# Altium schematic sheet Transmitter.SchDoc
size A4
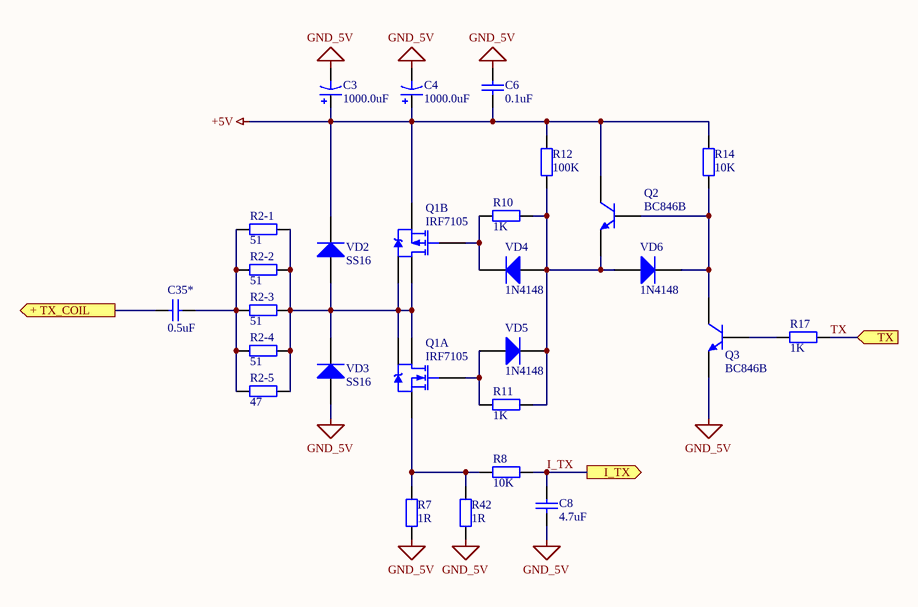
[diagram p0: Transmitter.SchDoc]

## Parts
C3  1000.0uF  [Capacitor-10X20-LYINGR]
C4  1000.0uF  [Capacitor-10X20-LYINGR]
C6  0.1uF  [1206_SMD_Capacitor]
C8  4.7uF  [1206_SMD_Capacitor]
C35*  0.5uF  [K71-7-LYING]
Q1  IRF7105  [SO-2]  (parts A,B of 2)
Q2  BC846B  [SOT23_N]
Q3  BC846B  [SOT23_N]
R2-1  51  [1206_SMD_Resistor]
R2-2  51  [1206_SMD_Resistor]
R2-3  51  [1206_SMD_Resistor]
R2-4  51  [1206_SMD_Resistor]
R2-5  47  [1206_SMD_Resistor]
R7  1R  [1206_SMD_Resistor]
R8  10K  [1206_SMD_Resistor]
R10  1K  [1206_SMD_Resistor]
R11  1K  [1206_SMD_Resistor]
R12  100K  [1206_SMD_Resistor]
R14  10K  [1206_SMD_Resistor]
R17  1K  [1206_SMD_Resistor]
R42  1R  [1206_SMD_Resistor]
VD2  SS16  [SMA]
VD3  SS16  [SMA]
VD4  1N4148  [SOD-323]
VD5  1N4148  [SOD-323]
VD6  1N4148  [SOD-323]

## Ports
+ TX_COIL (out), I_TX (out), TX (in)

## Nets
+5V: C3.1 C4.1 C6.1 Q1.3(S) Q2.3(C) R12.2 R14.2 VD2.2(K)
GND_5V: C3.2 C4.2 C6.2 C8.1 Q3.2(E) R7.2 R42.2 VD3.1(A)
+ TX_COIL: C35*.1 ; port + TX_COIL
I_TX: C8.2 R8.1 ; port I_TX
TX: R17.2 ; port TX
NetC35*_2: C35*.2 R2-1.1 R2-2.1 R2-3.1 R2-4.1 R2-5.1
NetQ1_1: Q1.1(S) R7.1 R8.2 R42.1
NetQ1_2: Q1.2(G) R11.2 VD5.1(A)
NetQ1_4: Q1.4(G) R10.2 VD4.2(K)
NetQ1_5: Q1.5(D) Q1.6 Q1.7(D) Q1.8 R2-1.2 R2-2.2 R2-3.2 R2-4.2 R2-5.2 VD2.1(A) VD3.2(K)
NetQ2_1: Q2.1(B) Q3.3(C) R14.1 VD6.2(K)
NetQ2_2: Q2.2(E) R10.1 R11.1 R12.1 VD4.1(A) VD5.2(K) VD6.1(A)
NetQ3_1: Q3.1(B) R17.1

## Library data of the parts
C3 C4 = Cap Pol1: Polarized Capacitor (Radial); Published: 8-Jun-2000; LatestRevisionDate: 17-Jul-2002; LatestRevisionNote: Re-released for DXP Platform.; PackageReference: RB7.6-15; Publisher: Altium Limited; PackageDescription: Polarized Capacitor (Radial); 2 Leads; Value: 1000.0uF
C6 C8 = Capacitor SMD: Capacitor; Published: 8-Jun-2000; LatestRevisionDate: 17-Jul-2002; LatestRevisionNote: Re-released for DXP Platform.; PackageReference: RAD-0.3; Publisher: Altium Limited
  C6: Value: 0.1uF
  C8: Value: 4.7uF
C35* = Capacitor K71-7: Capacitor; Published: 8-Jun-2000; LatestRevisionDate: 17-Jul-2002; LatestRevisionNote: Re-released for DXP Platform.; PackageReference: RAD-0.3; Publisher: Altium Limited; Value: 0.5uF
Q2 Q3 = BC846B: NPN General-purpose Transistor; Published: 17-Sep-2003; LatestRevisionDate: 12-Dec-2006; LatestRevisionNote: IPC-7351 Footprint Added.; DatasheetVersion: 4-Feb-2002; PackageVersion: May-1999; PackageReference: SOT23; Publisher: Altium Limited; PackageDescription: 3-Pin SOT-23 Package 0.95 mm Pitch, 2.3 mm Lead Span; ComponentLink1Description: Manufacturer Link; ComponentLink1URL: http://www.semiconductors.philips.com/; ComponentLink2Description: Datasheet; ComponentLink2URL: http://www.semiconductors.philips.com/acrobat/datasheets/BC846_BC847_BC848_5.pdf
R2-1-R2-5 R7 R8 R10-R12 R14 R17 R42 = Resistor: Published: 8-Jun-2000; LatestRevisionDate: 17-Jul-2002; LatestRevisionNote: Re-released for DXP Platform.; PackageReference: AXIAL-0.4; Publisher: Altium Limited; PackageDescription: Axial Device, Thru-Hole; 2 Leads; 0.4 in Pin Spacing
  R2-1-R2-4: Value: 51
  R2-5: Value: 47
  R7 R42: Value: 1R
  R8 R14: Value: 10K
  R10 R11 R17: Value: 1K
  R12: Value: 100K
VD2 VD3 = Diode: Default Diode; Published: 8-Jun-2000; LatestRevisionDate: 17-Jul-2002; LatestRevisionNote: Re-released for DXP Platform.; PackageVersion: Sep-1996; PackageReference: SMC; Publisher: Altium Limited; PackageDescription: DO-214-AB/SMC; 2 C-Bend Leads; Body 7.9 x 5.9 mm, inc. leads (LxW); Code_JEDEC: DO-214-AB
VD4-VD6 = 1N4148: High Conductance Fast Diode; Published: 8-Jun-2000; LatestRevisionDate: 17-Jul-2002; LatestRevisionNote: Re-released for DXP Platform.; DatasheetDocument: 1997; PackageReference: DO-35; Publisher: Altium Limited; Code_JEDEC: DO-204-AH; ComponentLink1Description: Manufacturer Link; ComponentLink1URL: http://www.fairchildsemi.com/; ComponentLink2Description: Datasheet; ComponentLink2URL: http://www.fairchildsemi.com/ds/1N%2F1N4148.pdf